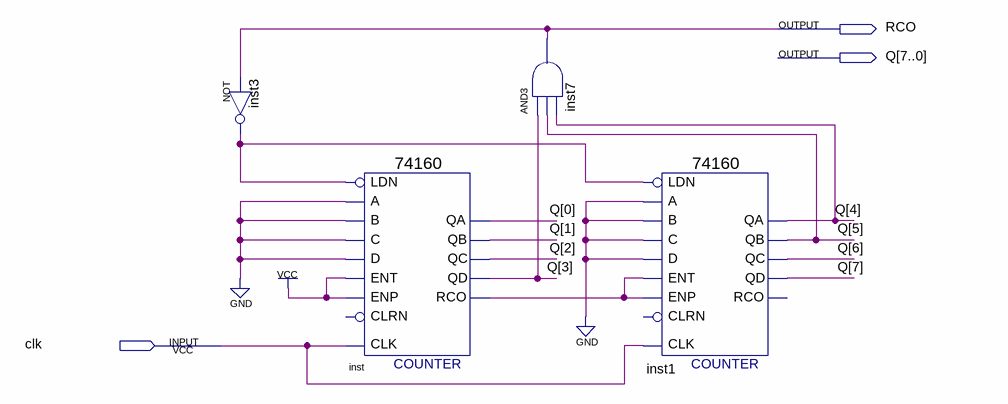
[diagram p0: schematic sheet]
// Quartus schematic Counter.bdf as structural Verilog: 4 symbols, 3 pins
module Counter (
  input  clk,
  output RCO,
  output [7:0] Q
);

  wire inst3_out, inst_rco;

  not inst3 (inst3_out, RCO);
  \74160  inst (
    .CLK(clk), .ENT(1'b1), .A(1'b0), .B(1'b0), .C(1'b0), .D(1'b0), .LDN(inst3_out), .ENP(1'b1), .QD(Q[3]),
    .QA(Q[0]), .QB(Q[1]), .QC(Q[2]), .RCO(inst_rco));  // open: CLRN
  and inst7 (RCO, Q[3], Q[5], Q[4]);
  \74160  inst1 (
    .CLK(clk), .ENT(inst_rco), .A(1'b0), .B(1'b0), .C(1'b0), .D(1'b0), .LDN(inst3_out), .ENP(inst_rco),
    .QD(Q[7]), .QA(Q[4]), .QB(Q[5]), .QC(Q[6]));  // open: CLRN, RCO
endmodule
